# Altium project PROC114E3_SCH.PrjPcb (part 5 of 22)

## Sheet 16.SchDoc
size 513 x 386 mm
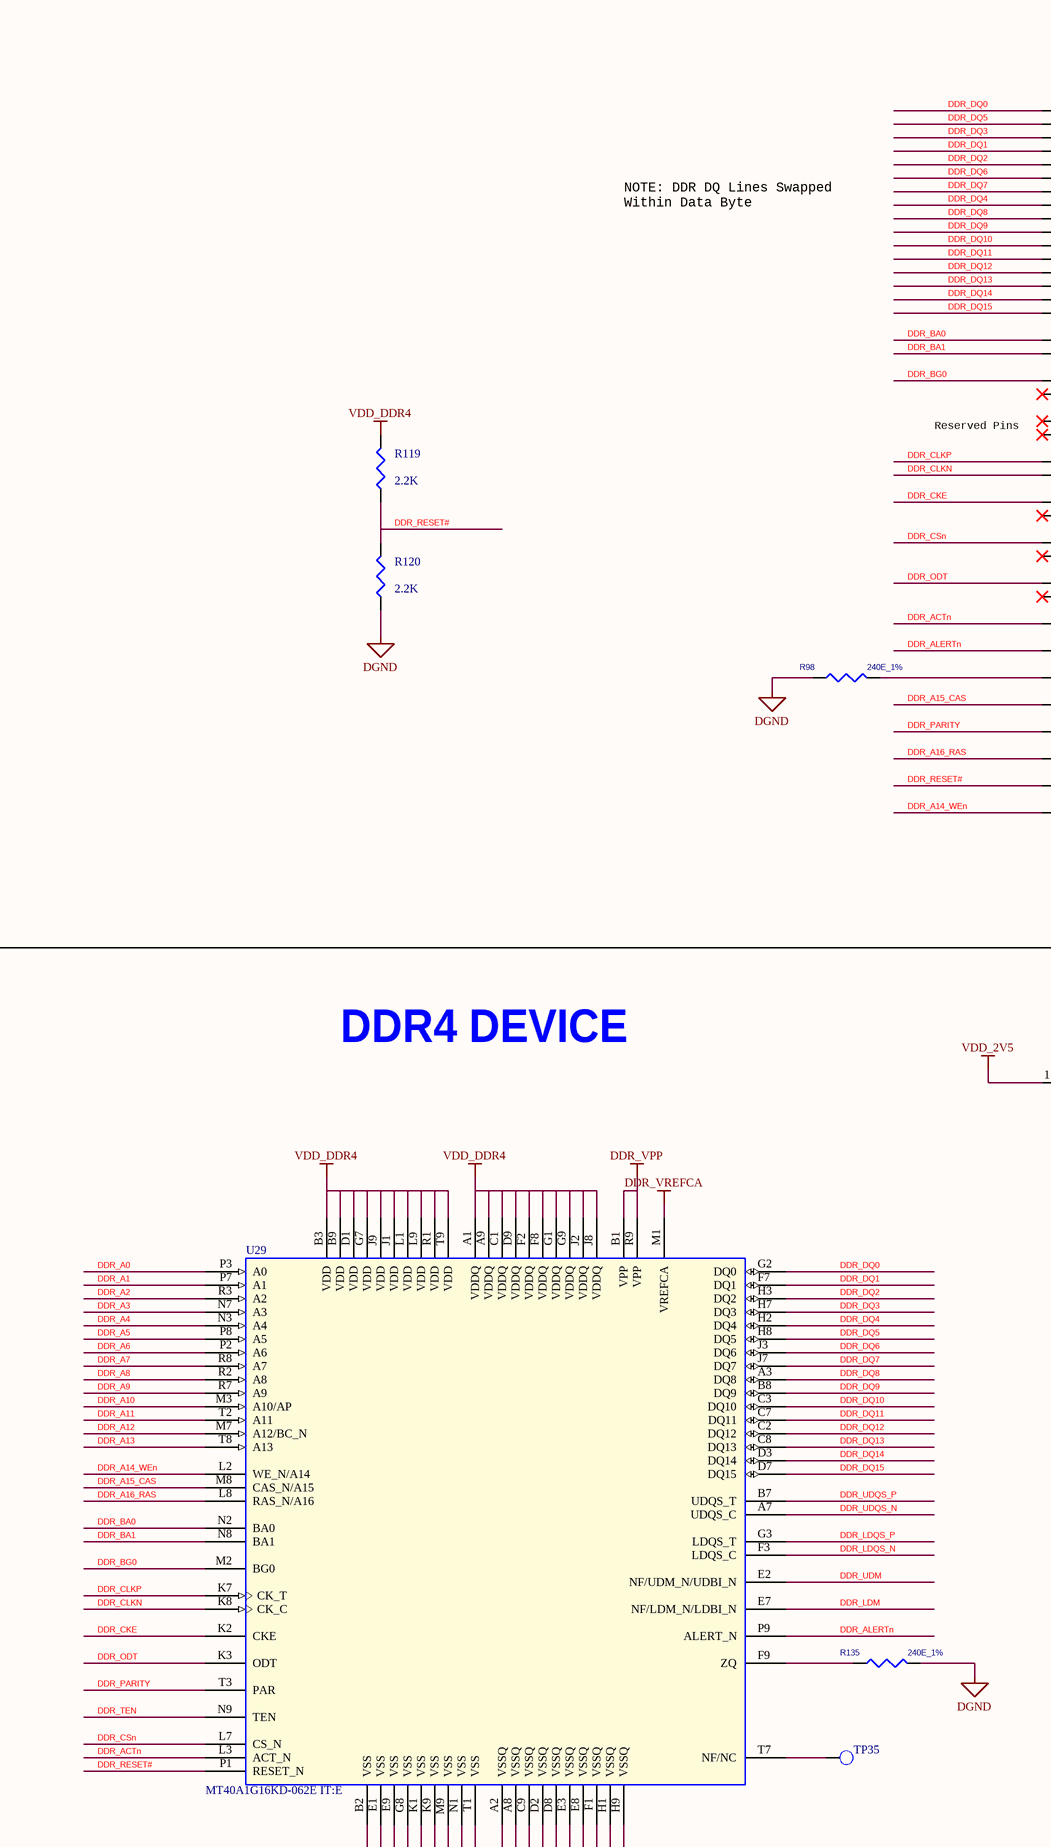
[diagram p21: 16.SchDoc, top left]
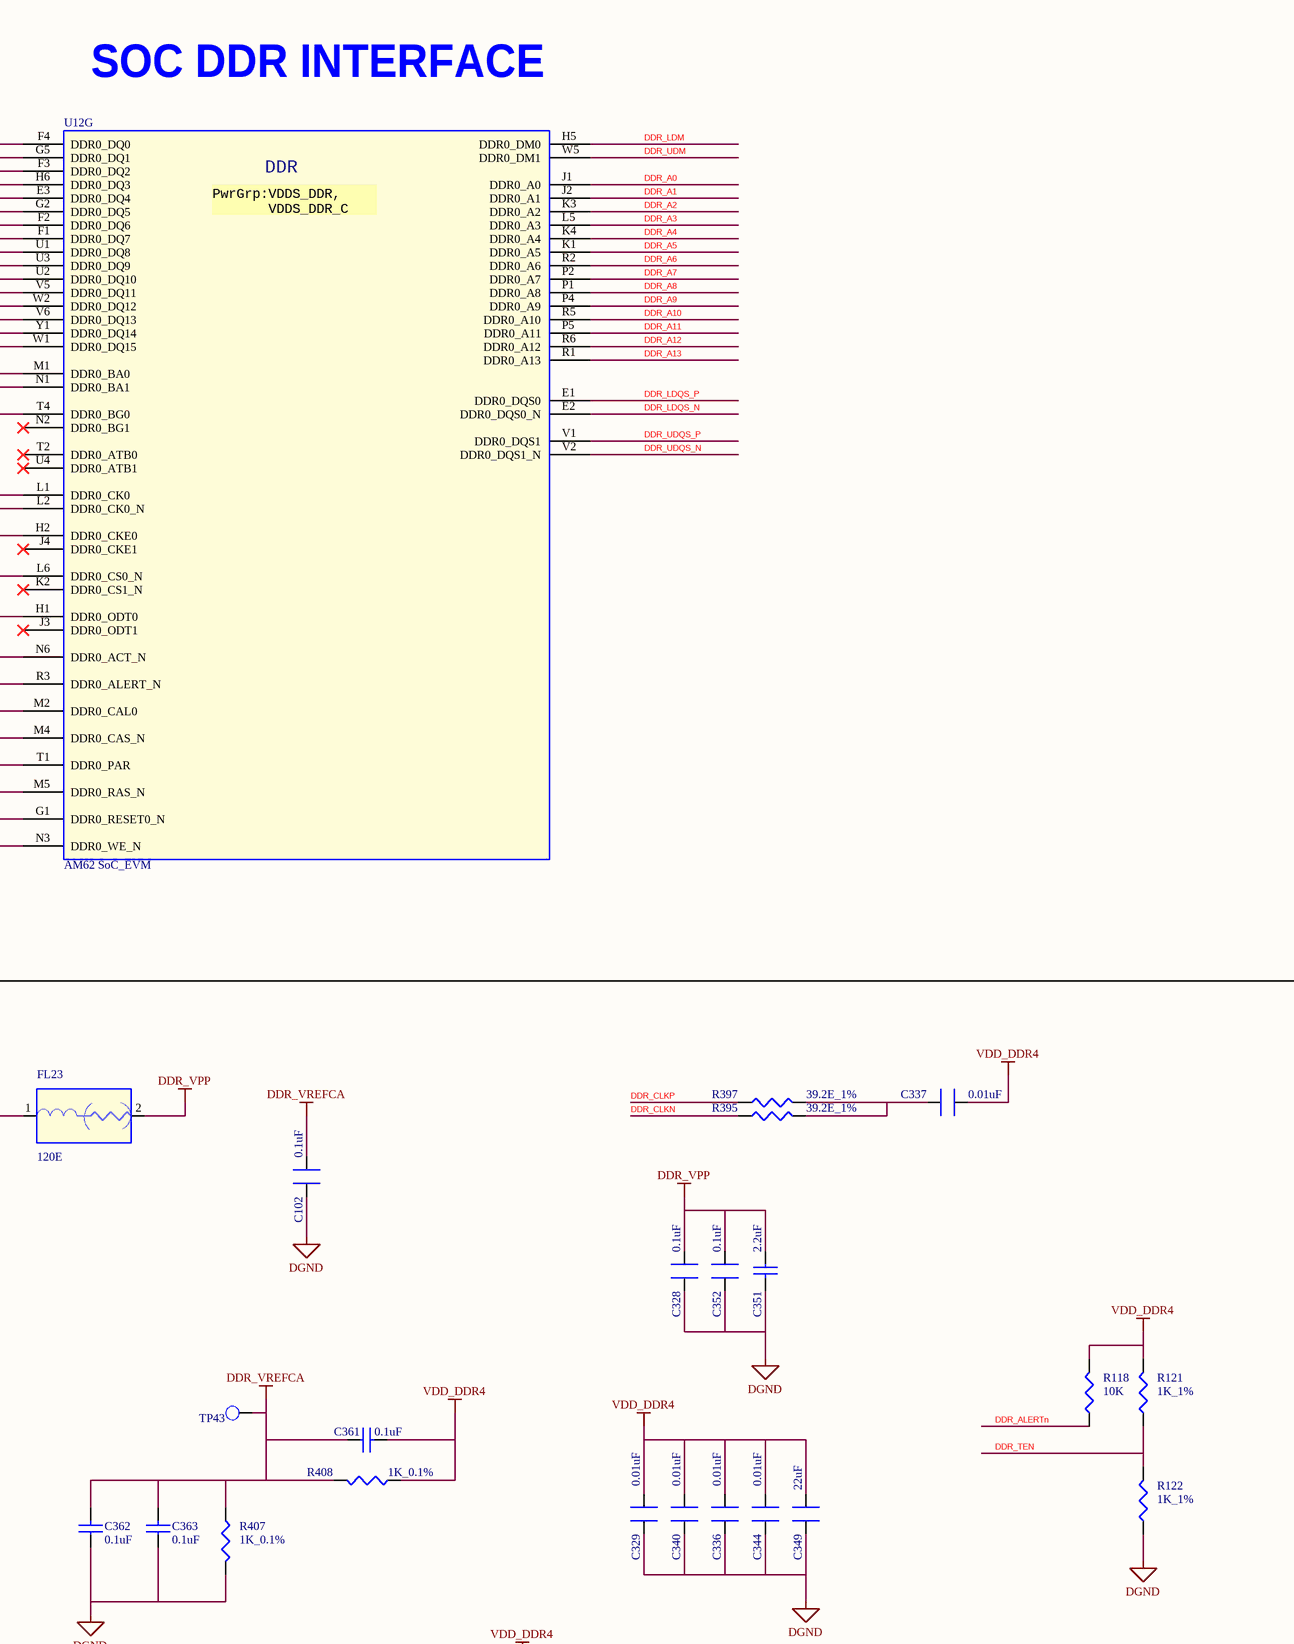
[diagram p22: 16.SchDoc, top right]
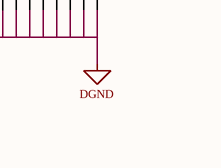
[diagram p23: 16.SchDoc, bottom left]
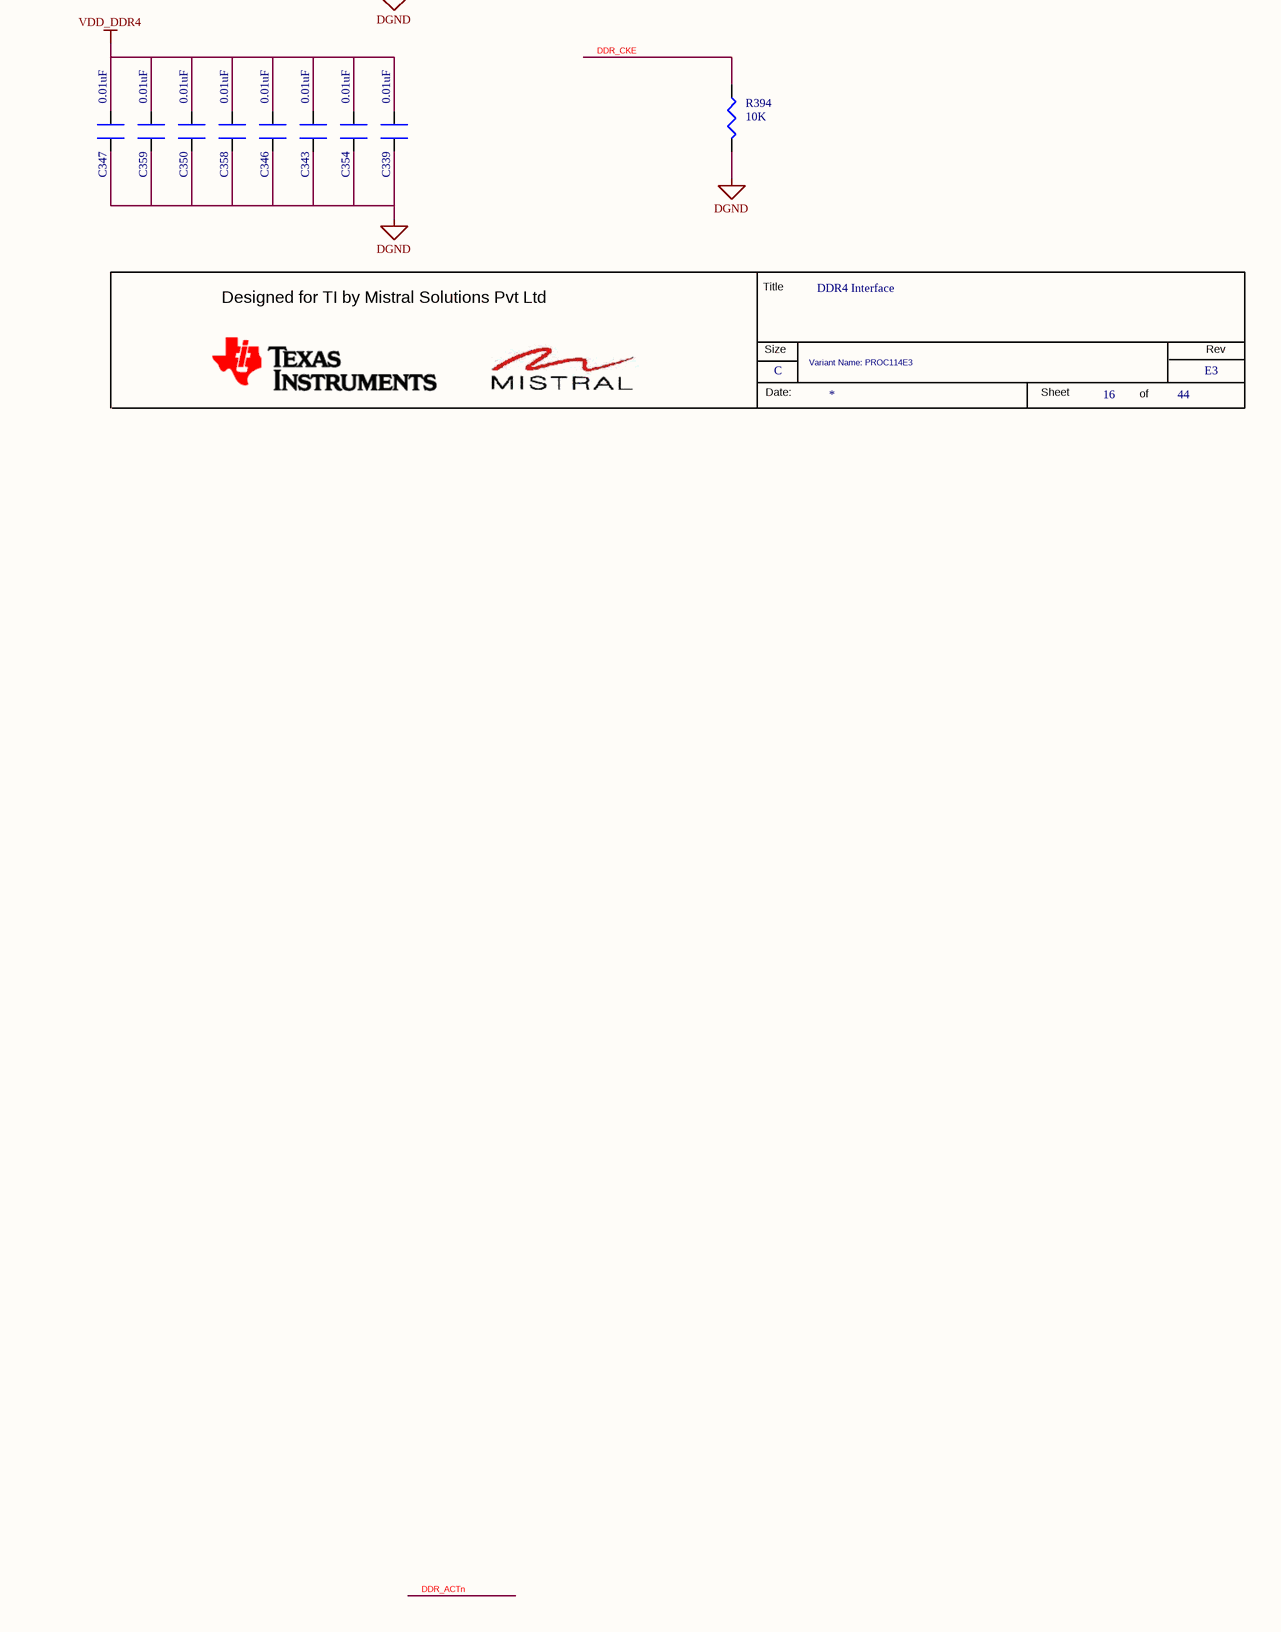
[diagram p24: 16.SchDoc, bottom right]

### Parts
(Parts that share a designator on the sheet are numbered #1, #2 ... from top to bottom, then left to right.)
*#16  RevCode: E3  Title: DDR4 Interface  Page Size: C  Page Number: 16  Page Count: 44  Variant Name: PROC114E3  (hidden comment: MISTRAL_TITLEBLK_CSIZE)  (graphical)
C102  0.1uF  [CAP0402N]
C328  0.1uF  [CAP0402N]
C329  0.01uF  [CAP0402N]
C336  0.01uF  [CAP0402N]
C337  0.01uF  [CAP0402N]
C339  0.01uF  [CAP0402N]
C340  0.01uF  [CAP0402N]
C343  0.01uF  [CAP0402N]
C344  0.01uF  [CAP0402N]
C346  0.01uF  [CAP0402N]
C347  0.01uF  [CAP0402N]
C349  22uF  [CAP0402N]
C350  0.01uF  [CAP0402N]
C351  2.2uF  [CAP0402_0-75]
C352  0.1uF  [CAP0402N]
C354  0.01uF  [CAP0402N]
C358  0.01uF  [CAP0402N]
C359  0.01uF  [CAP0402N]
C361  0.1uF  [CAP0201_0-5]
C362  0.1uF  [CAP0201_0-5]
C363  0.1uF  [CAP0201_0-5]
FL23  120E  [EMIFIL_BLM15A_0402_0-6]
R98  240E_1%  [RES0402N]
R118  10K  [RES0201_0-5]
R119  2.2K  [RES0201_0-5]
R120  2.2K  [RES0402_0-5]
R121  1K_1%  [RES0402_0-5]
R122  1K_1%  [RES0402_0-5]
R135  240E_1%  [RES0402N]
R394  10K  [RES0201_0-5]
R395  39.2E_1%  [RES0402_0-5]
R397  39.2E_1%  [RES0402_0-5]
R407  1K_0.1%  [RES0201_0-5]
R408  1K_0.1%  [RES0201_0-5]
TP35  TP20_SMD  [TP20_SMD]  (value not drawn)
TP43  TP20_SMD  [TP20_SMD]  (value not drawn)
U12#2  AM62 SoC_EVM  [BGA425_19-68_510X510_0-7]  (part G of 18)
U29  MT40A1G16KD-062E IT:E  [FBGA96_31-49_520X360_1-2]

### Nets
DDR_VPP: C328.2 C351.1 C352.2 FL23.2 U29.B1(VPP) U29.R9(VPP)
DDR_VREFCA: C102.2 C361.1 C362.2 C363.2 R407.1 R408.2 TP43.1(TP) U29.M1(VREFCA)
DGND: C102.1 C328.1 C329.2 C336.2 C339.2 C340.2 C343.2 C344.2 C346.2 C347.2 C349.2 C350.2 C351.2 C352.1 C354.2 C358.2 C359.2 C362.1 C363.1 R98.2 R120.1 R122.1 R135.2 R394.2 R407.2 U29.A2(VSSQ) U29.A8(VSSQ) U29.B2(VSS) U29.C9(VSSQ) U29.D2(VSSQ) U29.D8(VSSQ) U29.E1(VSS) U29.E3(VSSQ) U29.E8(VSSQ) U29.E9(VSS) U29.F1(VSSQ) U29.G8(VSS) U29.H1(VSSQ) U29.H9(VSSQ) U29.K1(VSS) U29.K9(VSS) U29.M9(VSS) U29.N1(VSS) U29.T1(VSS)
VDD_2V5: FL23.1
VDD_DDR4: C329.1 C336.1 C337.2 C339.1 C340.1 C343.1 C344.1 C346.1 C347.1 C349.1 C350.1 C354.1 C358.1 C359.1 C361.2 R118.2 R119.2 R121.2 R408.1 U29.A1(VDDQ) U29.A9(VDDQ) U29.B3(VDD) U29.B9(VDD) U29.C1(VDDQ) U29.D1(VDD) U29.D9(VDDQ) U29.F2(VDDQ) U29.F8(VDDQ) U29.G1(VDDQ) U29.G7(VDD) U29.G9(VDDQ) U29.J1(VDD) U29.J2(VDDQ) U29.J8(VDDQ) U29.J9(VDD) U29.L1(VDD) U29.L9(VDD) U29.R1(VDD) U29.T9(VDD)
DDR_A0: U12#2.J1(DDR0_A0) U29.P3(A0)
DDR_A1: U12#2.J2(DDR0_A1) U29.P7(A1)
DDR_A2: U12#2.K3(DDR0_A2) U29.R3(A2)
DDR_A3: U12#2.L5(DDR0_A3) U29.N7(A3)
DDR_A4: U12#2.K4(DDR0_A4) U29.N3(A4)
DDR_A5: U12#2.K1(DDR0_A5) U29.P8(A5)
DDR_A6: U12#2.R2(DDR0_A6) U29.P2(A6)
DDR_A7: U12#2.P2(DDR0_A7) U29.R8(A7)
DDR_A8: U12#2.P1(DDR0_A8) U29.R2(A8)
DDR_A9: U12#2.P4(DDR0_A9) U29.R7(A9)
DDR_A10: U12#2.R5(DDR0_A10) U29.M3(A10/AP)
DDR_A11: U12#2.P5(DDR0_A11) U29.T2(A11)
DDR_A12: U12#2.R6(DDR0_A12) U29.M7(A12/BC_N)
DDR_A13: U12#2.R1(DDR0_A13) U29.T8(A13)
DDR_A14_WEn: U12#2.N3(DDR0_WE_N) U29.L2(WE_N/A14)
DDR_A15_CAS: U12#2.M4(DDR0_CAS_N) U29.M8(CAS_N/A15)
DDR_A16_RAS: U12#2.M5(DDR0_RAS_N) U29.L8(RAS_N/A16)
DDR_ACTn: U12#2.N6(DDR0_ACT_N) U29.L3(ACT_N)
DDR_ALERTn: R118.1 U12#2.R3(DDR0_ALERT_N) U29.P9(ALERT_N)
DDR_BA0: U12#2.M1(DDR0_BA0) U29.N2(BA0)
DDR_BA1: U12#2.N1(DDR0_BA1) U29.N8(BA1)
DDR_BG0: U12#2.T4(DDR0_BG0) U29.M2(BG0)
DDR_CKE: R394.1 U12#2.H2(DDR0_CKE0) U29.K2(CKE)
DDR_CLKN: R395.1 U12#2.L2(DDR0_CK0_N) U29.K8(CK_C)
DDR_CLKP: R397.1 U12#2.L1(DDR0_CK0) U29.K7(CK_T)
DDR_CSn: U12#2.L6(DDR0_CS0_N) U29.L7(CS_N)
DDR_DQ0: U12#2.F4(DDR0_DQ0) U29.G2(DQ0)
DDR_DQ1: U12#2.H6(DDR0_DQ3) U29.F7(DQ1)
DDR_DQ2: U12#2.E3(DDR0_DQ4) U29.H3(DQ2)
DDR_DQ3: U12#2.F3(DDR0_DQ2) U29.H7(DQ3)
DDR_DQ4: U12#2.F1(DDR0_DQ7) U29.H2(DQ4)
DDR_DQ5: U12#2.G5(DDR0_DQ1) U29.H8(DQ5)
DDR_DQ6: U12#2.G2(DDR0_DQ5) U29.J3(DQ6)
DDR_DQ7: U12#2.F2(DDR0_DQ6) U29.J7(DQ7)
DDR_DQ8: U12#2.U1(DDR0_DQ8) U29.A3(DQ8)
DDR_DQ9: U12#2.U3(DDR0_DQ9) U29.B8(DQ9)
DDR_DQ10: U12#2.U2(DDR0_DQ10) U29.C3(DQ10)
DDR_DQ11: U12#2.V5(DDR0_DQ11) U29.C7(DQ11)
DDR_DQ12: U12#2.W2(DDR0_DQ12) U29.C2(DQ12)
DDR_DQ13: U12#2.V6(DDR0_DQ13) U29.C8(DQ13)
DDR_DQ14: U12#2.Y1(DDR0_DQ14) U29.D3(DQ14)
DDR_DQ15: U12#2.W1(DDR0_DQ15) U29.D7(DQ15)
DDR_LDM: U12#2.H5(DDR0_DM0) U29.E7(NF/LDM_N/LDBI_N)
DDR_LDQS_N: U12#2.E2(DDR0_DQS0_N) U29.F3(LDQS_C)
DDR_LDQS_P: U12#2.E1(DDR0_DQS0) U29.G3(LDQS_T)
DDR_ODT: U12#2.H1(DDR0_ODT0) U29.K3(ODT)
DDR_PARITY: U12#2.T1(DDR0_PAR) U29.T3(PAR)
DDR_RESET#: R119.1 R120.2 U12#2.G1(DDR0_RESET0_N) U29.P1(RESET_N)
DDR_TEN: R121.1 R122.2 U29.N9(TEN)
DDR_UDM: U12#2.W5(DDR0_DM1) U29.E2(NF/UDM_N/UDBI_N)
DDR_UDQS_N: U12#2.V2(DDR0_DQS1_N) U29.A7(UDQS_C)
DDR_UDQS_P: U12#2.V1(DDR0_DQS1) U29.B7(UDQS_T)
NetC337_1: C337.1 R395.2 R397.2
NetR98_1: R98.1 U12#2.M2(DDR0_CAL0)
NetR135_1: R135.1 U29.F9(ZQ)
NetTP35_1: TP35.1(TP) U29.T7(NF/NC)

Not connected (* = marked no-connect by the designer): U12#2 J3(DDR0_ODT1)* J4(DDR0_CKE1)* K2(DDR0_CS1_N)* N2(DDR0_BG1)* T2(DDR0_ATB0)* U4(DDR0_ATB1)*

### Notes on the sheet
- SOC DDR INTERFACE
- NOTE: DDR DQ Lines Swapped
  Within Data Byte
- Reserved Pins
- DDR4 DEVICE
- (in symbol AM62-EVM_BGA425, part G) DDR; PwrGrp:VDDS_DDR, / VDDS_DDR_C
- (in symbol MISTRAL_TITLEBLK_CSIZE) Title; Designed for TI by Mistral Solutions Pvt Ltd; Size; Rev; Date:; Sheet; of

### Library data of the parts
*#16 = MISTRAL_TITLEBLK_CSIZE: Issue: 1.0; Page Create Date: March  8, 1995; Page Modify Date: *; Schematic Page Count: 44; Schematic Page Number: 16
C102 C328 C352 = CAP_Dup3: CAP CERAMIC 0.1uF 16V 10% X5R 0201; Part_type: CAPACITORS\CERAMIC; Mfr_part_number: GRM033R61C104KE14D; Mfr_name: MURATA; Mistral Part No: 120009030072-R; PCB Footprint: CAP0201_0-5; Custom_Duty: 15%; Customs_HS_Code: 85322990; Project: TI_MAXIE_CPB; Wattage: NA; Footprint Path: Y:\MIS_DATABASE\Library\ALTIUM_TOOL\PCB_FOOTPRINTS\Altium_Footprint_Lib.PcbLib; Library Path: Y:\MIS_DATABASE\Library\ALTIUM_TOOL\SCHEMATICS_PARTS\MS_DISCRETE_Library.schlib; Footprint Ref: CAP0201_0-5; Chkd/date: MANIRAJA/230118; Crtd /date: MANIRAJA/230118; Datasheet: Y:\MIS_DATABASE\DATASHEETS\CAPACITORS\GRM033R61C104KE14.PDF; Height: 0.33MM; Distributor_part_number: 490-14305-1-ND; Distributor_name: DIGIKEY; Package: 0201; Voltage: 16V; Tolerance: 10%; Weight: 0.33mg; Temperature: -55°C+85°C; MECHANICAL 3D STEP FILE: CAP0201_0-5; Library Ref: CAP
C329 C336 C340 C343 C344 C346 C347 C350 C354 C358 C359 = CAP_Dup3: as C51 on sheet 14; Footprint Path: Y:\MIS_DATABASE\Library\ALTIUM_TOOL\PCB_FOOTPRINTS\Altium_Footprint_Lib.PcbLib; Library Path: Y:\MIS_DATABASE\Library\ALTIUM_TOOL\SCHEMATICS_PARTS\MS_DISCRETE_Library.schlib; Footprint Ref: CAP0201_0-5; Library Ref: CAP; MECHANICAL 3D STEP FILE: CAP0201_0-5; Temperature: -55°C+85°C; Weight: 0.33mg; Chkd/date: MANIRAJA/230118; Crtd /date: MANIRAJA/230118; Datasheet: Y:\MIS_DATABASE\DATASHEETS\CAPACITORS\GRM033R61E103KA12.PDF; Height: 0.33MM; Distributor_part_number: GRM033R61E103KA12J-ND; Distributor_name: DIGIKEY; Package: 0201; Voltage: 25V; Tolerance: 10%
C337 = CAP_Dup3: as C90 on sheet 14; Footprint Path: Y:\MIS_DATABASE\Library\ALTIUM_TOOL\PCB_FOOTPRINTS\Altium_Footprint_Lib.PcbLib; Library Path: Y:\MIS_DATABASE\Library\ALTIUM_TOOL\SCHEMATICS_PARTS\MS_DISCRETE_Library.schlib; Footprint Ref: CAP0201_0-5; Tolerance: 10%; Voltage: 25V; Package: 0201; Distributor_name: DIGIKEY; Distributor_part_number: GRM033R61E103KA12J-ND; Height: 0.33MM; Datasheet: Y:\MIS_DATABASE\DATASHEETS\CAPACITORS\GRM033R61E103KA12.PDF; Crtd /date: MANIRAJA/230118; Chkd/date: MANIRAJA/230118; Weight: 0.33mg; Temperature: -55°C+85°C; MECHANICAL 3D STEP FILE: CAP0201_0-5; Library Ref: CAP
C339 = CAP_Dup3: CAP CERAMIC 0.01uF 25V 10% X5R 0201; Mistral Part No: 120018010007-R; Mfr_name: MURATA; Mfr_part_number: GRM033R61E103KA12J; Part_type: CAPACITORS\CERAMIC; PCB Footprint: CAP0201_0-5; Wattage: NA; Project: TI_MAXIE_CPB; Customs_HS_Code: 85322990; Custom_Duty: 15%; Footprint Path: Y:\MIS_DATABASE\Library\ALTIUM_TOOL\PCB_FOOTPRINTS\Altium_Footprint_Lib.PcbLib; Library Path: Y:\MIS_DATABASE\Library\ALTIUM_TOOL\SCHEMATICS_PARTS\MS_DISCRETE_Library.schlib; Footprint Ref: CAP0201_0-5; Library Ref: CAP; MECHANICAL 3D STEP FILE: CAP0201_0-5; Temperature: -55°C+85°C; Weight: 0.33mg; Tolerance: 10%; Voltage: 25V; Package: 0201; Distributor_name: DIGIKEY; Distributor_part_number: GRM033R61E103KA12J-ND; Height: 0.33MM; Datasheet: Y:\MIS_DATABASE\DATASHEETS\CAPACITORS\GRM033R61E103KA12.PDF; Crtd /date: MANIRAJA/230118; Chkd/date: MANIRAJA/230118
C349 = CAP_Dup3: CAP CERAMIC 22uF 10V 20% X5R 0603; Mistral Part No: 120014100009-R; Mfr_name: MURATA; Mfr_part_number: GRM188R61A226ME15D; Part_type: CAPACITORS\CERAMIC; PCB Footprint: CAP0603_1; Project: TI_MAXIE_CPB; Wattage: NA; Customs_HS_Code: 85322990; Custom_Duty: 15%; Footprint Path: Y:\MIS_DATABASE\Library\ALTIUM_TOOL\PCB_FOOTPRINTS\Altium_Footprint_Lib.PcbLib; Library Path: Y:\MIS_DATABASE\Library\ALTIUM_TOOL\SCHEMATICS_PARTS\MS_DISCRETE_Library.schlib; MECHANICAL 3D STEP FILE: CAP0603_1; Footprint Ref: CAP0603_1; Library Ref: CAP; Tolerance: 20%; Voltage: 10V; Package: 0603; Distributor_name: DIGIKEY; Distributor_part_number: 490-10476-1-ND; Height: 1.00MM; Weight: 6.3mg; Temperature: -55°C+85°C; Datasheet: Y:\MIS_DATABASE\DATASHEETS\CAPACITORS\GRM188R61A226ME15.PDF; Crtd /date: MANIRAJA/230118; Chkd/date: MANIRAJA/230118
C351 = CAP_Dup2: CAP CERAMIC 2.2uF 25V 10% X5R 0402; Mistral Part No: 120015120001-R; Mfr_name: MURATA; Mfr_part_number: GRM155R61E225KE11D; Part_type: CAPACITORS\CERAMIC; Project: TI_AM263X_CC; Wattage: NA; Customs_HS_Code: 85322990; Custom_Duty: 15%; PCB Footprint: CAP0402_0-75; Footprint Path: Y:\MIS_DATABASE\Library\ALTIUM_TOOL\PCB_FOOTPRINTS\Altium_Footprint_Lib.PcbLib; Library Path: Y:\MIS_DATABASE\Library\ALTIUM_TOOL\SCHEMATICS_PARTS\MS_DISCRETE_Library.schlib; Footprint Ref: CAP0402_0-75; Library Ref: CAP; Tolerance: 10%; Voltage: 25V; Package: 0402; Distributor_name: DIGIKEY; Distributor_part_number: 490-12703-1-ND; Height: 0.70MM; Weight: 1.5mg; Temperature: -55°C+85°C; Datasheet: Y:\MIS_DATABASE\DATASHEETS\CAPACITORS\GRM155R61E225KE11.PDF; Crtd /date: MANIRAJA/010721; Chkd/date: ALVY/010721; MECHANICAL 3D STEP FILE: CAP0402_0-75
C361-C363 = CAP_Dup2: CAP CERAMIC 0.1uF 16V 10% X5R 0201; Alt_Mfr_part_number: CC0402KRX5R8BB104; Mistral Part No: 120009030072-R; Mfr_name: MURATA; Mfr_part_number: GRM033R61C104KE14D; Part_type: CAPACITORS\CERAMIC; Alt_Mfr_name: YAGEO AMERICA; Project: TI_MAXIE_CPB; Wattage: NA; Customs_HS_Code: 85322990; Custom_Duty: 15%; PCB Footprint: CAP0201_0-5; Tolerance: 10%; Voltage: 16V; Package: 0201; Distributor_name: DIGIKEY; Distributor_part_number: 490-14305-1-ND; Height: 0.33MM; Weight: 0.33mg; Temperature: -55°C+85°C; Datasheet: Y:\MIS_DATABASE\DATASHEETS\CAPACITORS\GRM033R61C104KE14.PDF; Crtd /date: MANIRAJA/230118; Chkd/date: MANIRAJA/230118; MECHANICAL 3D STEP FILE: CAP0201_0-5; Library Ref: CAP; Footprint Ref: CAP0201_0-5; Library Path: Y:\MIS_DATABASE\Library\ALTIUM_TOOL\SCHEMATICS_PARTS\MS_DISCRETE_Library.schlib; Footprint Path: Y:\MIS_DATABASE\Library\ALTIUM_TOOL\PCB_FOOTPRINTS\Altium_Footprint_Lib.PcbLib
FL23 = EMIFILTER_IND: as FL3 on sheet 14; PCB Footprint: EMIFIL_BLM15A_0402_0-6; Footprint Ref: EMIFIL_BLM15A_0402_0-6; Wattage: NA; Package: 0402; Distributor_name: DIGIKEY; Distributor_part_number: 490-9656-1-ND; Library Ref: EMIFILTER_IND; Height: 0.55MM; Weight: 1mg; Temperature: -55°C+125°C; Datasheet: Y:\MIS_DATABASE\DATASHEETS\DISCRETES\INDUCTORS\BLM15-SN1-SER.PDF; Crtd /date: USMAN/170613; Chkd/date: NAVEED/241114; MECHANICAL 3D STEP FILE: EMIFIL_BLM15A_0402_0-6; Library Path: Y:\MIS_DATABASE\Library\ALTIUM_TOOL\SCHEMATICS_PARTS\MS_FILTER_Library.schlib; Footprint Path: Y:\MIS_DATABASE\Library\ALTIUM_TOOL\PCB_FOOTPRINTS\Altium_Footprint_Lib.PcbLib
R98 = RESISTOR_Dup5: RES 240E 1/10W 1% 0402; Mistral Part No: 110011060017-R; Mfr_name: PANASONIC-ECG; Mfr_part_number: ERJ-2RKF2400X; Part_type: RESISTORS\FIXED; PCB Footprint: RES0402_0-5; Project: AM4515_EVM_LCD; Voltage: NA; Customs_HS_Code: 85332119; Custom_Duty: 15%; Footprint Path: Y:\MIS_DATABASE\Library\ALTIUM_TOOL\PCB_FOOTPRINTS\Altium_Footprint_Lib.PcbLib; Library Path: Y:\MIS_DATABASE\Library\ALTIUM_TOOL\SCHEMATICS_PARTS\MS_DISCRETE_Library.schlib; MECHANICAL 3D STEP FILE: RES0402_0-5; Footprint Ref: RES0402_0-5; Tolerance: 1%; Wattage: 1/10W; Package: 0402; Distributor_name: DIGIKEY; Distributor_part_number: P240LCT-ND; Height: 0.40MM; Weight: 0.8mg; Temperature: -55°C+155°C; Datasheet: Y:\MIS_DATABASE\DATASHEETS\RESISTORS\PAN-ERJSER_NOV17.PDF; Crtd /date: BAVISH/020611; Chkd/date: MAZHAR/150611; Library Ref: RESISTOR
R118 R394 = RESISTOR_Dup6: RES 10K 1/20W 5% 0201; Part_type: RESISTORS\FIXED; Mfr_part_number: RC0201JR-0710KL; Mfr_name: YAGEO AMERICA; Mistral Part No: 110010070051-R; Custom_Duty: 15%; Customs_HS_Code: 85332119; Voltage: NA; Project: GOLDEN-I LITE; PCB Footprint: RES0201_0-5; MECHANICAL 3D STEP FILE: RES0201_0-5; Chkd/date: MANIRAJA/050517; Crtd /date: MANIRAJA/050517; Datasheet: Y:\MIS_DATABASE\DATASHEETS\RESISTORS\RCXXXXL-SER_MAR18.PDF; Temperature: -55°C+125°C; Weight: 0.17mg; Height: 0.26MM; Distributor_part_number: 311-10KNCT-ND; Distributor_name: DIGIKEY; Package: 0201; Wattage: 1/20W; Tolerance: 5%; Library Ref: RESISTOR; Footprint Ref: RES0201_0-5; Library Path: Y:\MIS_DATABASE\Library\ALTIUM_TOOL\SCHEMATICS_PARTS\MS_DISCRETE_Library.schlib; Footprint Path: Y:\MIS_DATABASE\Library\ALTIUM_TOOL\PCB_FOOTPRINTS\Altium_Footprint_Lib.PcbLib
R119 = RESISTOR_Dup6: RES 2.2K 1/20W 5% 0201; Mistral Part No: 110009030427-R; Mfr_name: PANASONIC-ECG; Mfr_part_number: ERJ-1GEJ222C; Part_type: RESISTORS\FIXED; Project: G4SLIM; Voltage: NA; Customs_HS_Code: 85332119; Custom_Duty: 15%; PCB Footprint: RES0201_0-5; Library Path: Y:\MIS_DATABASE\Library\ALTIUM_TOOL\SCHEMATICS_PARTS\MS_DISCRETE_Library.schlib; Footprint Ref: RES0201_0-5; Footprint Path: Y:\MIS_DATABASE\Library\ALTIUM_TOOL\PCB_FOOTPRINTS\Altium_Footprint_Lib.PcbLib; Tolerance: 5%; Wattage: 1/20W; Package: 0201; Distributor_name: DIGIKEY; Distributor_part_number: P2.2KAGCT-ND; Height: 0.26MM; Weight: 0.15mg; Temperature: -55°C+125°C; Datasheet: Y:\MIS_DATABASE\DATASHEETS\RESISTORS\PAN-ERJXGE-FEB06.PDF; Crtd /date: MAZHAR/010605; Chkd/date: VASANTHA/010117; MECHANICAL 3D STEP FILE: RES0201_0-5; Library Ref: RESISTOR
R120 = RESISTOR_Dup6: RES 2.2K 1/16W 5% 0402; Mistral Part No: 110010120018-R; Mfr_name: YAGEO AMERICA; Mfr_part_number: RC0402JR-072K2L; Part_type: RESISTORS\FIXED; Project: TE4; Voltage: NA; Customs_HS_Code: 85332119; Custom_Duty: 15%; PCB Footprint: RES0402_0-5; Library Path: Y:\MIS_DATABASE\Library\ALTIUM_TOOL\SCHEMATICS_PARTS\MS_DISCRETE_Library.schlib; Footprint Ref: RES0402_0-5; Footprint Path: Y:\MIS_DATABASE\Library\ALTIUM_TOOL\PCB_FOOTPRINTS\Altium_Footprint_Lib.PcbLib; Tolerance: 5%; Wattage: 1/16W; Package: 0402; Distributor_name: DIGIKEY; Distributor_part_number: 311-2.2KJRCT-ND; Height: 0.40MM; Weight: 0.65mg; Temperature: -55°C+155°C; Datasheet: Y:\MIS_DATABASE\DATASHEETS\RESISTORS\RCXXXXL-SER_MAR18.PDF; Crtd /date: BAVISH/021210; Chkd/date: VASANTHA/061216; MECHANICAL 3D STEP FILE: RES0402_0-5; Library Ref: RESISTOR
R121 = RESISTOR_Dup4: RES 1K 1/10W 1% 0402; Mistral Part No: 110009030411-R; Mfr_name: PANASONIC-ECG; Mfr_part_number: ERJ-2RKF1001X; Part_type: RESISTORS\FIXED; Project: VOCERA; Voltage: NA; Customs_HS_Code: 85332119; Custom_Duty: 15%; PCB Footprint: RES0402_0-5; Footprint Path: Y:\MIS_DATABASE\Library\ALTIUM_TOOL\PCB_FOOTPRINTS\Altium_Footprint_Lib.PcbLib; Library Path: Y:\MIS_DATABASE\Library\ALTIUM_TOOL\SCHEMATICS_PARTS\MS_DISCRETE_Library.schlib; MECHANICAL 3D STEP FILE: RES0402_0-5; Footprint Ref: RES0402_0-5; Library Ref: RESISTOR; Tolerance: 1%; Wattage: 1/10W; Package: 0402; Distributor_name: DIGIKEY; Distributor_part_number: P1.00KLCT-ND; Height: 0.40MM; Weight: 0.8mg; Temperature: -55°C+155°C; Datasheet: Y:\MIS_DATABASE\DATASHEETS\RESISTORS\PAN-ERJSER_NOV17.PDF; Crtd /date: MAZHAR/150506; Chkd/date: VASANTHA/281216
R122 = RESISTOR_Dup4: RES 1K 1/10W 1% 0402; Part_type: RESISTORS\FIXED; Mfr_part_number: ERJ-2RKF1001X; Mfr_name: PANASONIC-ECG; Mistral Part No: 110009030411-R; Custom_Duty: 15%; Customs_HS_Code: 85332119; Voltage: NA; Project: VOCERA; PCB Footprint: RES0402_0-5; Chkd/date: VASANTHA/281216; Crtd /date: MAZHAR/150506; Datasheet: Y:\MIS_DATABASE\DATASHEETS\RESISTORS\PAN-ERJSER_NOV17.PDF; Temperature: -55°C+155°C; Weight: 0.8mg; Height: 0.40MM; Distributor_part_number: P1.00KLCT-ND; Distributor_name: DIGIKEY; Package: 0402; Wattage: 1/10W; Tolerance: 1%; Library Ref: RESISTOR; Footprint Ref: RES0402_0-5; MECHANICAL 3D STEP FILE: RES0402_0-5; Library Path: Y:\MIS_DATABASE\Library\ALTIUM_TOOL\SCHEMATICS_PARTS\MS_DISCRETE_Library.schlib; Footprint Path: Y:\MIS_DATABASE\Library\ALTIUM_TOOL\PCB_FOOTPRINTS\Altium_Footprint_Lib.PcbLib
R135 = RESISTOR_Dup5: RES 240E 1/10W 1% 0402; Part_type: RESISTORS\FIXED; Mfr_part_number: ERJ-2RKF2400X; Mfr_name: PANASONIC-ECG; Mistral Part No: 110011060017-R; PCB Footprint: RES0402_0-5; Custom_Duty: 15%; Customs_HS_Code: 85332119; Voltage: NA; Project: AM4515_EVM_LCD; Footprint Path: Y:\MIS_DATABASE\Library\ALTIUM_TOOL\PCB_FOOTPRINTS\Altium_Footprint_Lib.PcbLib; Library Path: Y:\MIS_DATABASE\Library\ALTIUM_TOOL\SCHEMATICS_PARTS\MS_DISCRETE_Library.schlib; MECHANICAL 3D STEP FILE: RES0402_0-5; Footprint Ref: RES0402_0-5; Chkd/date: MAZHAR/150611; Crtd /date: BAVISH/020611; Datasheet: Y:\MIS_DATABASE\DATASHEETS\RESISTORS\PAN-ERJSER_NOV17.PDF; Temperature: -55°C+155°C; Weight: 0.8mg; Height: 0.40MM; Distributor_part_number: P240LCT-ND; Distributor_name: DIGIKEY; Package: 0402; Wattage: 1/10W; Tolerance: 1%; Library Ref: RESISTOR
R395 R397 = RESISTOR_Dup6: RES 39.2E 1/16W 1% 0402; Mistral Part No: 110011040030-R; Mfr_name: STACKPOLE ELECTRONICS; Mfr_part_number: RMCF0402FT39R2; Part_type: RESISTORS\FIXED; Project: AOD_POD-BASECARD; Voltage: NA; Customs_HS_Code: 85332119; Custom_Duty: 15%; PCB Footprint: RES0402_0-5; Tolerance: 1%; Wattage: 1/16W; Package: 0402; Distributor_name: DIGIKEY; Distributor_part_number: RMCF0402FT39R2CT-ND; Height: 0.40MM; Weight: 0.57mg; Temperature: -55°C+155°C; Datasheet: Y:\MIS_DATABASE\DATASHEETS\RESISTORS\RMCF-SER_JUL18.PDF; Crtd /date: MAZHAR/210411; Chkd/date: RAGESH/210411; Library Ref: RESISTOR; Footprint Ref: RES0402_0-5; MECHANICAL 3D STEP FILE: RES0402_0-5; Library Path: Y:\MIS_DATABASE\Library\ALTIUM_TOOL\SCHEMATICS_PARTS\MS_DISCRETE_Library.schlib; Footprint Path: Y:\MIS_DATABASE\Library\ALTIUM_TOOL\PCB_FOOTPRINTS\Altium_Footprint_Lib.PcbLib
R407 R408 = RESISTOR_Dup4: RES 1K 1/20W 0.1% 0201; Mistral Part No: 110019050021-R; Mfr_name: PANASONIC-ECG; Mfr_part_number: ERA-1AEB102C; Part_type: RESISTORS\FIXED; Project: AM263x_CC_BRD; Voltage: NA; Customs_HS_Code: 85332119; Custom_Duty: 15%; Footprint Path: Y:\MIS_DATABASE\Library\ALTIUM_TOOL\PCB_FOOTPRINTS\Altium_Footprint_Lib.PcbLib; Library Path: Y:\MIS_DATABASE\Library\ALTIUM_TOOL\SCHEMATICS_PARTS\MS_DISCRETE_Library.schlib; MECHANICAL 3D STEP FILE: RES0201_0-5; Footprint Ref: RES0201_0-5; Library Ref: RESISTOR; Tolerance: 0.1%; Wattage: 1/20W; Package: 0201; Distributor_name: DIGIKEY; Distributor_part_number: P1.0KBXCT-ND; Height: 0.26MM; Weight: 0.14mg; Temperature: -55°C+155°C; Datasheet: Y:\MIS_DATABASE\DATASHEETS\RESISTORS\ERA-1A.PDF; Crtd /date: ALVY/160222; Chkd/date: ALVY/160222; PCB Footprint: RES0201_0-5
TP35 TP43 = TESTPOINT: as TP37 on sheet 13; PCB Footprint: TP20_SMD; Customs_HS_Code: NA; Chkd/date: SHREESHAIL/171006; Crtd /date: MAZHAR/171006; Height: NA; Distributor_part_number: NA; Distributor_name: NA; Package: SMD; Part_type: TESTPOINT; Mfr_part_number: TP20_SMD; Mistral Part No: NA; Tolerance: NA; Voltage: NA; Wattage: NA; Weight: NA; Temperature: NA; Datasheet: NA; MECHANICAL 3D STEP FILE: NA; Library Path: Y:\MIS_DATABASE\Library\ALTIUM_TOOL\SCHEMATICS_PARTS\MS_DISCRETE_Library.schlib; Footprint Path: Y:\MIS_DATABASE\Library\ALTIUM_TOOL\PCB_FOOTPRINTS\Altium_Footprint_Lib.PcbLib; Library Ref: TESTPOINT; Footprint Ref: TP20_SMD; RoHS: NA
U12#2 = AM62-EVM_BGA425: IC AM62 SoC MICROPROCESSOR BGA425; Mistral Part No: 141221060001; Mfr_name: TEXAS INSTRUMENTS; Part_type: ICS\DIGITAL\MICROPROCESSOR; Project: AM62_EVM_BRD; Tolerance: NA; Customs_HS_Code: 85423100; Custom_Duty: 15%; Mfr_part_number: AM62 SoC_EVM; Voltage: NA; Wattage: NA; Package: BGA425; Distributor_name: NA; Distributor_part_number: NA; Library Ref: AM62-EVM_BGA425; Footprint Ref: BGA425_19-68_510X510_0-7; Height: 0.65MM; Weight: NA; Temperature: NA; Datasheet: Y:\MIS_DATABASE\DATASHEETS\ICS\DIGITAL\MICROCONTROLLER\AM62-SoC_SVB.PDF; Crtd /date: MANIRAJA/110621; Chkd/date: ALVY/110621; RoHS: NA; MECHANICAL 3D STEP FILE: BGA425_19-68_510X510_0-7; Library Path: Y:\MIS_DATABASE\Library\ALTIUM_TOOL\SCHEMATICS_PARTS\MS_MICROPROCESSOR_Library.schlib; Footprint Path: Y:\MIS_DATABASE\Library\ALTIUM_TOOL\PCB_FOOTPRINTS\Altium_Footprint_Lib.PcbLib; PCB Footprint: BGA425_19-68_510X510_0-7
U29 = MT40A512M16LY_FBGA96: IC 16Gb DDR4 SDRAM FBGA96; Part_type: ICS\DIGITAL\MEMORY; Mfr_name: MICRON; Mistral Part No: 141120080005-R; Custom_Duty: 15%; Customs_HS_Code: 85423100; Wattage: NA; Project: AM64x_EVM_BRD; PCB Footprint: FBGA96_31-49_520X360_1-2; Footprint Path: Y:\MIS_DATABASE\Library\ALTIUM_TOOL\PCB_FOOTPRINTS\Altium_Footprint_Lib.PcbLib; Library Path: Y:\MIS_DATABASE\Library\ALTIUM_TOOL\SCHEMATICS_PARTS\MS_MISCMEMORY_Library.schlib; MECHANICAL 3D STEP FILE: FBGA96_31-49_520X360_1-2; Chkd/date: MANIRAJA/280820; Crtd /date: ALVY/280820; Datasheet: Y:\MIS_DATABASE\DATASHEETS\ICS\MEMORY\MT40A-SER.PDF; Temperature: -40°C+95°C; Weight: NA; Height: 1.20MM; Library Ref: MT40A512M16LY_FBGA96; Distributor_part_number: 340-457244-TRAY; Distributor_name: MOUSER; Package: FBGA96; Voltage: NA; Tolerance: NA; Mfr_part_number: MT40A1G16KD-062E IT:E; Footprint Ref: FBGA96_31-49_520X360_1-2